# Altium schematic sheet TopLevel.SCHDOC: Smart_DCDC TopLevel
size A4; Organization: UNSW Solar Racing Team; Address3: UNSW; Address4: Sydney NSW 2052; Address2: Electrical Engineering; Address1: Rm 109
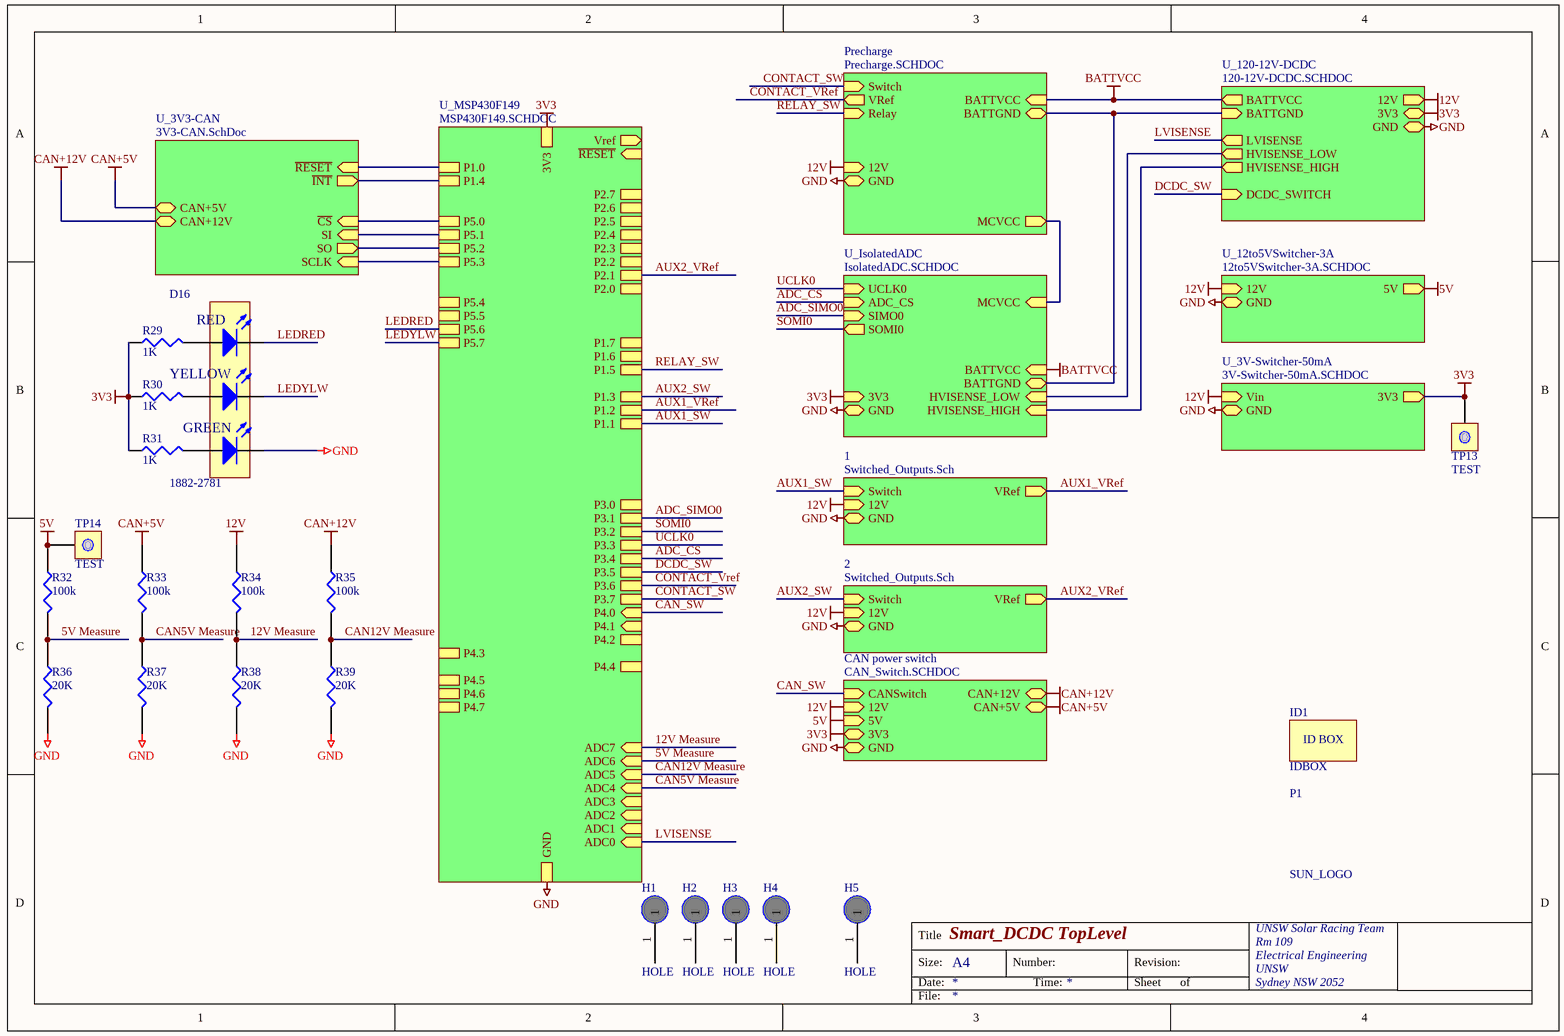
[diagram p0: TopLevel.SCHDOC]

## Parts
D16  1882-2781  [LED_TRILEVEL]
H1  HOLE  [#6]
H2  HOLE  [#6]
H3  HOLE  [#6]
H4  HOLE  [#6]
H5  HOLE  [#6]
ID1  IDBOX  [IDBOX]
P1  SUN_LOGO  [SUNSWIFTLOGO]
R29  1K  [0603]
R30  1K  [0603]
R31  1K  [0603]
R32  100k  [1206]
R33  100k  [1206]
R34  100k  [1206]
R35  100k  [1206]
R36  20K  [1206]
R37  20K  [1206]
R38  20K  [1206]
R39  20K  [1206]
TP13  TEST  [TESTPOINT]
TP14  TEST  [TESTPOINT]

## Sub-sheets
1 = Switched_Outputs.Sch: Switch (in), VRef (out), 12V (in), GND (bidir)
2 = Switched_Outputs.Sch: Switch (in), VRef (out), 12V (in), GND (bidir)
CAN power switch = CAN_Switch.SCHDOC: 12V (in), CAN+12V (bidir), GND (bidir), CANSwitch (in), 5V (in), CAN+5V (bidir), 3V3
Precharge = Precharge.SCHDOC: BATTVCC (in), BATTGND (bidir), GND (bidir), 12V (in), Relay (in), Switch (in), VRef (out), MCVCC (out)
U_3V3-CAN = 3V3-CAN.SchDoc: SI (in), SO (out), ~{CS} (in), SCLK (in), ~{INT} (out), ~{RESET} (in), CAN+5V (bidir), CAN+12V (bidir)
U_3V-Switcher-50mA = 3V-Switcher-50mA.SCHDOC: GND (bidir), 3V3, Vin (in)
U_12to5VSwitcher-3A = 12to5VSwitcher-3A.SCHDOC: 12V (in), GND (bidir), 5V (out)
U_120-12V-DCDC = 120-12V-DCDC.SCHDOC: BATTVCC (out), BATTGND, 12V (out), GND (bidir), 3V3, LVISENSE (out), HVISENSE_LOW (out), HVISENSE_HIGH (out), DCDC_SWITCH (in)
U_IsolatedADC = IsolatedADC.SCHDOC: UCLK0 (in), ADC_CS (in), SIMO0 (in), SOMI0 (out), BATTGND, GND (bidir), BATTVCC (in), MCVCC (in), HVISENSE_LOW (in), HVISENSE_HIGH (in), 3V3 (in)
U_MSP430F149 = MSP430F149.SCHDOC: GND, 3V3, ADC0 (in), ADC1 (in), ADC2 (in), ADC3 (in), ADC4 (in), ADC5 (in), ADC6 (in), ADC7 (in), P1.0, P1.1, P1.2, P1.3, P1.4, P1.5, P1.6, P1.7, P2.0, P2.1, P2.2, P2.3, P2.4, P2.5, P2.6, P2.7, P3.0, P3.1, P3.2, P3.3, P3.4, Vref (out), ~{RESET} (in), P3.5, P3.6, P3.7, P4.0 (in), P4.1 (in), P4.2, P4.3, P4.4, P4.5, P4.6, P4.7, P5.0, P5.1, P5.2, P5.3, P5.4, P5.5, P5.6, P5.7

## Nets
3V3: R29.1 R30.1 R31.1 TP13.0(TP) ; sheet U_MSP430F149/3V3, sheet U_120-12V-DCDC/3V3, sheet U_3V-Switcher-50mA/3V3, sheet CAN power switch/3V3, sheet U_IsolatedADC/3V3
5V: R32.1 TP14.0(TP) ; sheet U_12to5VSwitcher-3A/5V, sheet CAN power switch/5V
12V: R34.1 ; sheet U_120-12V-DCDC/12V, sheet U_12to5VSwitcher-3A/12V, sheet U_3V-Switcher-50mA/Vin, sheet 1/12V, sheet 2/12V, sheet Precharge/12V, sheet CAN power switch/12V
BATTVCC: sheet U_120-12V-DCDC/BATTVCC, sheet Precharge/BATTVCC, sheet U_IsolatedADC/BATTVCC
CAN+5V: R33.1 ; sheet U_3V3-CAN/CAN+5V, sheet CAN power switch/CAN+5V
CAN+12V: R35.1 ; sheet U_3V3-CAN/CAN+12V, sheet CAN power switch/CAN+12V
GND: D16.1(K) R36.2 R37.2 R38.2 R39.2 ; sheet U_MSP430F149/GND, sheet U_120-12V-DCDC/GND, sheet U_12to5VSwitcher-3A/GND, sheet U_3V-Switcher-50mA/GND, sheet 1/GND, sheet 2/GND, sheet Precharge/GND, sheet CAN power switch/GND, sheet U_IsolatedADC/GND
5V Measure: R32.2 R36.1 ; sheet U_MSP430F149/ADC6
12V Measure: R34.2 R38.1 ; sheet U_MSP430F149/ADC7
ADC_CS: sheet U_MSP430F149/P3.4, sheet U_IsolatedADC/ADC_CS
ADC_SIMO0: sheet U_MSP430F149/P3.1, sheet U_IsolatedADC/SIMO0
AUX1_SW: sheet U_MSP430F149/P1.1, sheet 1/Switch
AUX1_VRef: sheet U_MSP430F149/P1.2, sheet 1/VRef
AUX2_SW: sheet U_MSP430F149/P1.3, sheet 2/Switch
AUX2_VRef: sheet U_MSP430F149/P2.1, sheet 2/VRef
CAN5V Measure: R33.2 R37.1 ; sheet U_MSP430F149/ADC4
CAN12V Measure: R35.2 R39.1 ; sheet U_MSP430F149/ADC5
CAN_SW: sheet U_MSP430F149/P4.0, sheet CAN power switch/CANSwitch
CONTACT_SW: sheet U_MSP430F149/P3.7, sheet Precharge/Switch
CONTACT_Vref: sheet U_MSP430F149/P3.6, sheet Precharge/VRef
DCDC_SW: sheet U_MSP430F149/P3.5, sheet U_120-12V-DCDC/DCDC_SWITCH
LEDRED: D16.3(K) ; sheet U_MSP430F149/P5.6
LEDYLW: D16.2(K) ; sheet U_MSP430F149/P5.7
LVISENSE: sheet U_MSP430F149/ADC0, sheet U_120-12V-DCDC/LVISENSE
RELAY_SW: sheet U_MSP430F149/P1.5, sheet Precharge/Relay
SOMI0: sheet U_MSP430F149/P3.2, sheet U_IsolatedADC/SOMI0
UCLK0: sheet U_MSP430F149/P3.3, sheet U_IsolatedADC/UCLK0
NetD16_4: D16.4(A) R29.2
NetD16_5: D16.5(A) R30.2
NetD16_6: D16.6(A) R31.2
(unnamed): sheet U_MSP430F149/P1.0, sheet U_3V3-CAN/~{RESET}
(unnamed): sheet U_MSP430F149/P1.4, sheet U_3V3-CAN/~{INT}
(unnamed): sheet U_MSP430F149/P5.0, sheet U_3V3-CAN/~{CS}
(unnamed): sheet U_MSP430F149/P5.1, sheet U_3V3-CAN/SI
(unnamed): sheet U_MSP430F149/P5.2, sheet U_3V3-CAN/SO
(unnamed): sheet U_MSP430F149/P5.3, sheet U_3V3-CAN/SCLK
(unnamed): sheet U_120-12V-DCDC/BATTGND, sheet Precharge/BATTGND, sheet U_IsolatedADC/BATTGND
(unnamed): sheet U_120-12V-DCDC/HVISENSE_LOW, sheet U_IsolatedADC/HVISENSE_LOW
(unnamed): sheet U_120-12V-DCDC/HVISENSE_HIGH, sheet U_IsolatedADC/HVISENSE_HIGH
(unnamed): sheet Precharge/MCVCC, sheet U_IsolatedADC/MCVCC

Not connected (* = marked no-connect by the designer): H1 1; H2 1; H3 1; H4 1; H5 1

## Notes on the sheet
- Title
- Size:
- Date:
- A4
- Number:
- Time:
- Revision:
- Sheet
- of
- File:
- (in symbol IDBOX) ID BOX
- (in symbol LED-TRILEVEL) RED; YELLOW; GREEN

## Library data of the parts
D16 = LED-TRILEVEL: Three level LED; Farnell: 1461596
H1-H5 = HOLE: Order#: NA; Supplier: NA; Price: NA
R29-R31 = RES1: Resistor; Order#: 9331697; Supplier: Farnell; Price: 0.05
R32-R39 = RES1: Price: 1.16; Digikey: -
  R32-R35: Farnell: 308-6422
  R36-R39: Farnell: 308-6252
TP13 TP14 = TEST: TEST POINT